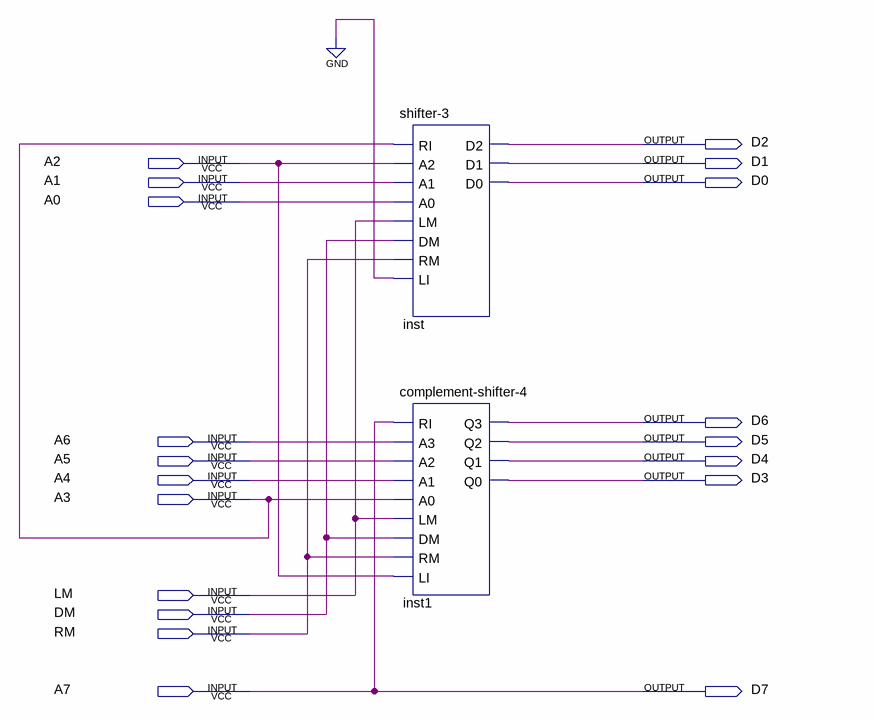
[diagram p0: schematic sheet]
// Quartus schematic shifter-8.bdf as structural Verilog: 2 symbols, 19 pins
module \shifter-8  (
  input  A2,
  input  A1,
  input  A0,
  input  A6,
  input  A5,
  input  A4,
  input  A3,
  input  LM,
  input  DM,
  input  RM,
  input  A7,
  output D2,
  output D1,
  output D0,
  output D6,
  output D5,
  output D4,
  output D3,
  output D7
);

  \shifter-3  inst (
    .RI(A3), .A2(A2), .A1(A1), .A0(A0), .LM(LM), .DM(DM), .RM(RM), .LI(1'b0), .D2(D2), .D1(D1), .D0(D0));
  \complement-shifter-4  inst1 (
    .RI(A7), .A3(A6), .A2(A5), .A1(A4), .A0(A3), .LM(LM), .DM(DM), .RM(RM), .LI(A2), .Q3(D6), .Q2(D5),
    .Q1(D4), .Q0(D3));

  assign D7 = A7;
endmodule
